# EasyEDA Pro project ProPrj_PRISM102 Peripheral Control_2026-04-10.epro

# Schematic Schematic1

## Sheets
1 Drivers / DC-DC: Assembly Variant: Basic; Board Name: Board1; Create Date: 2026-03-30; Page Name: P1; Project Name: PRISM Peri Control; Schematic Name: Schematic1; Update Date: 2026-03-30; BladeWidth: 10; Page Size: A4; RegionStart: 1; ShowBorder: 1; TitleBlock: 1; TitleBlockPosition: 3; Version: V1.0; XRegionCount: 6; YRegionCount: 4
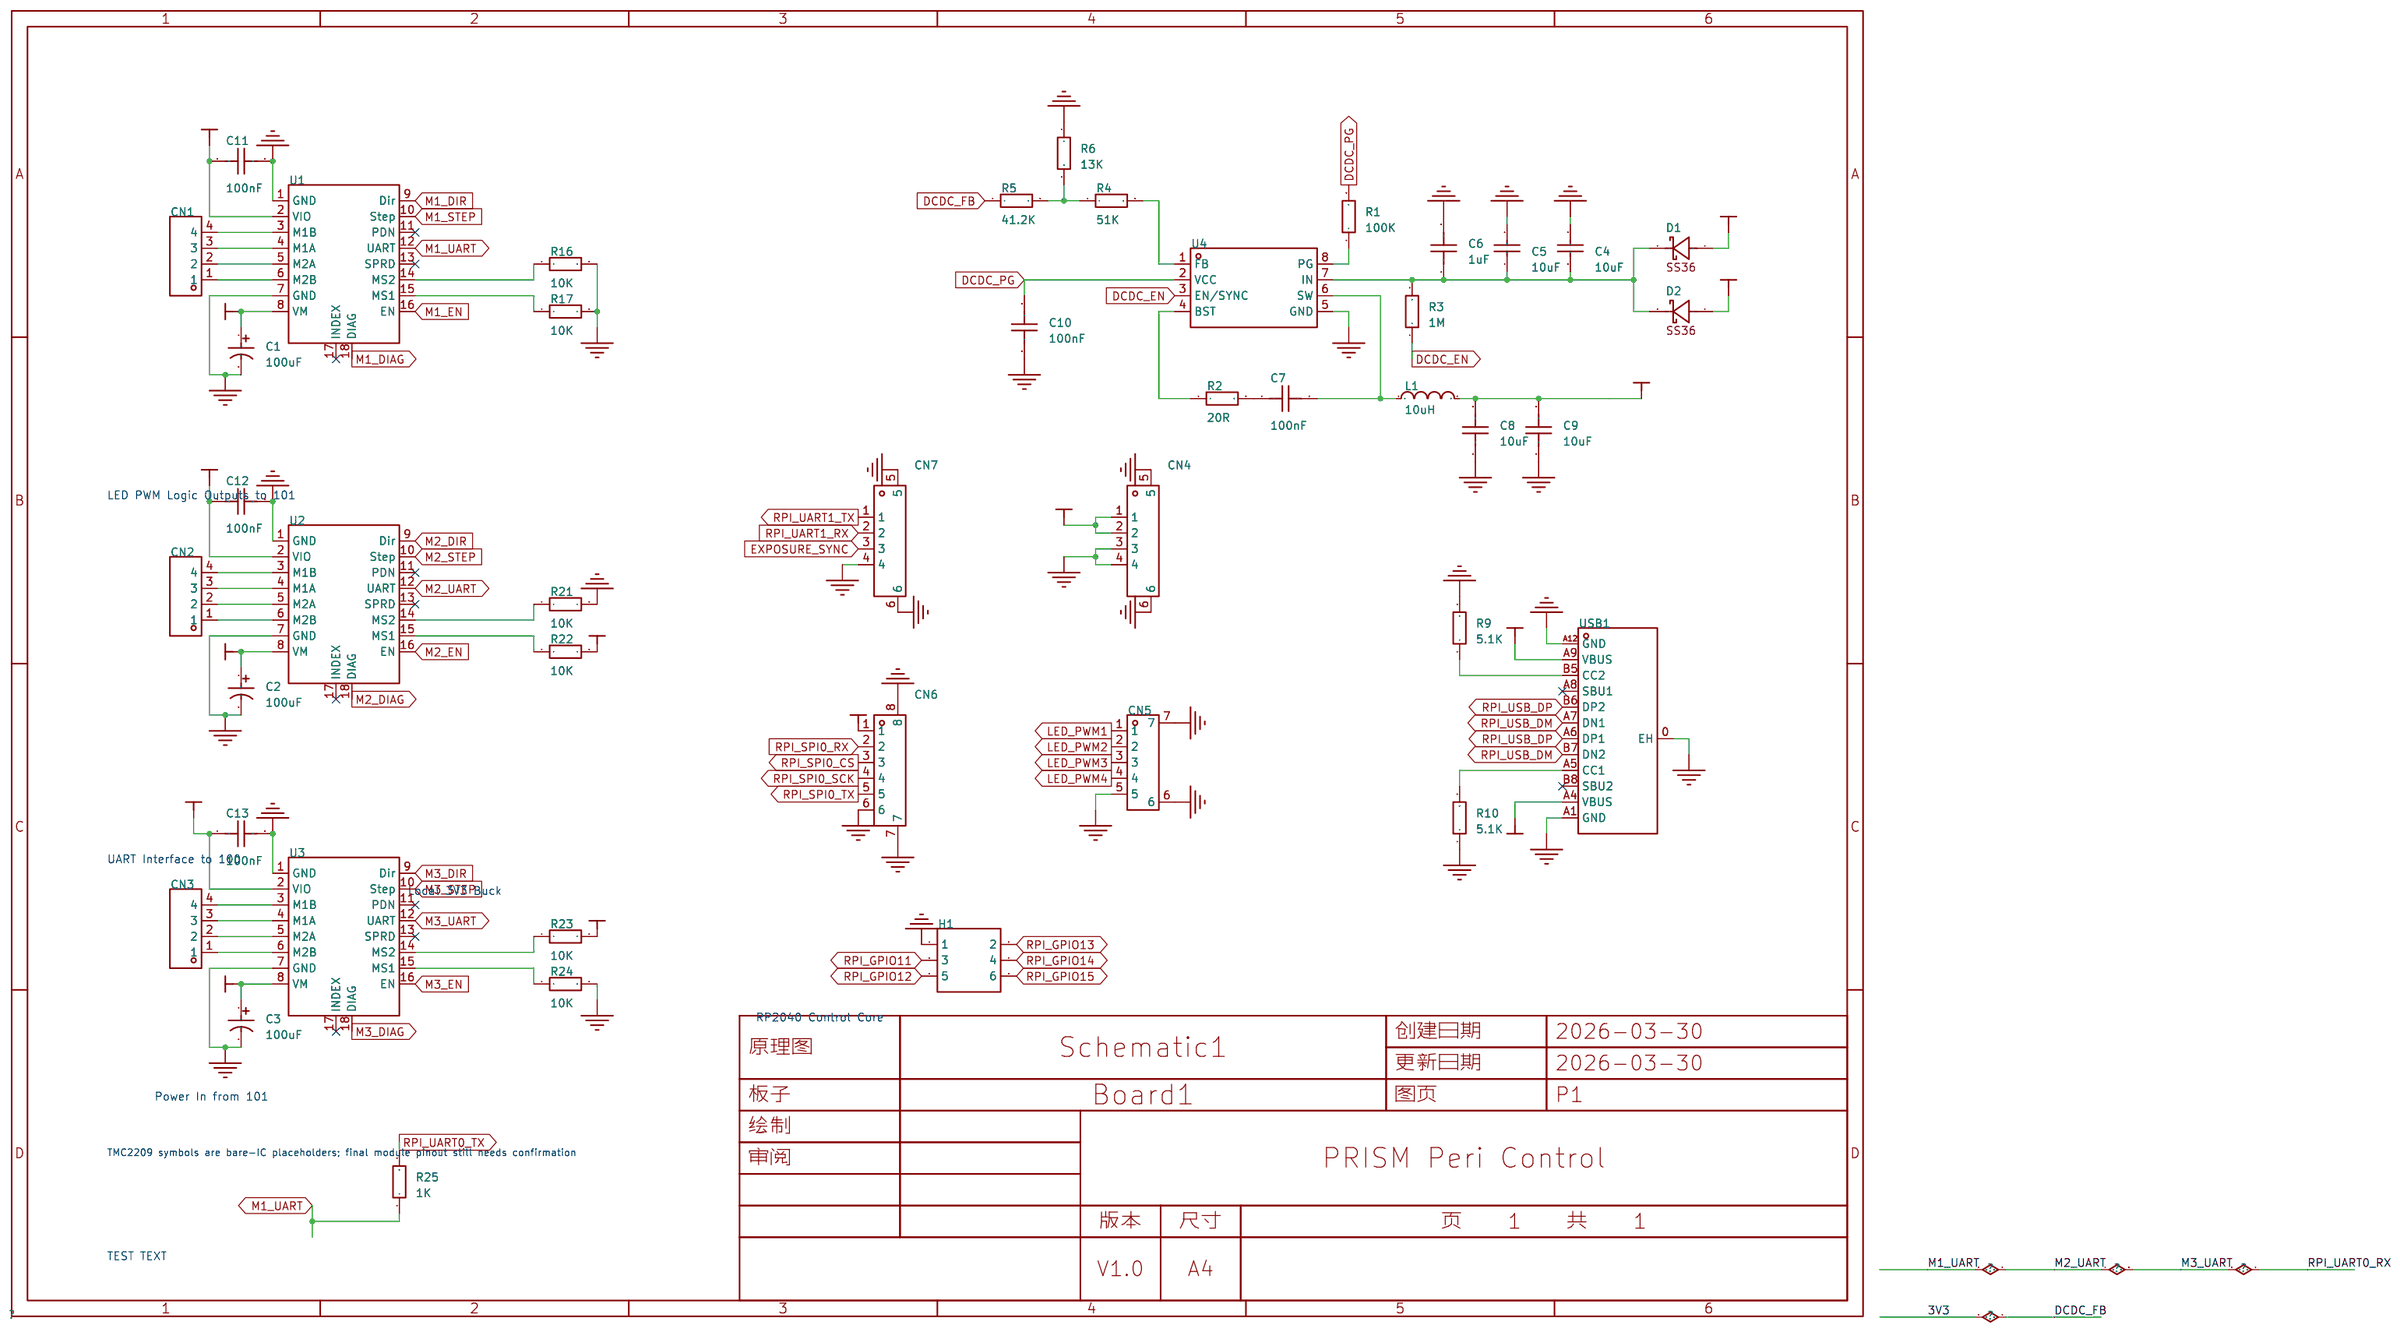
[diagram p0: Drivers / DC-DC]
2 P2_RP2040: Create Date: 2026-04-01; Project Name: PRISM102 Peripheral Control; Update Date: 2026-04-01
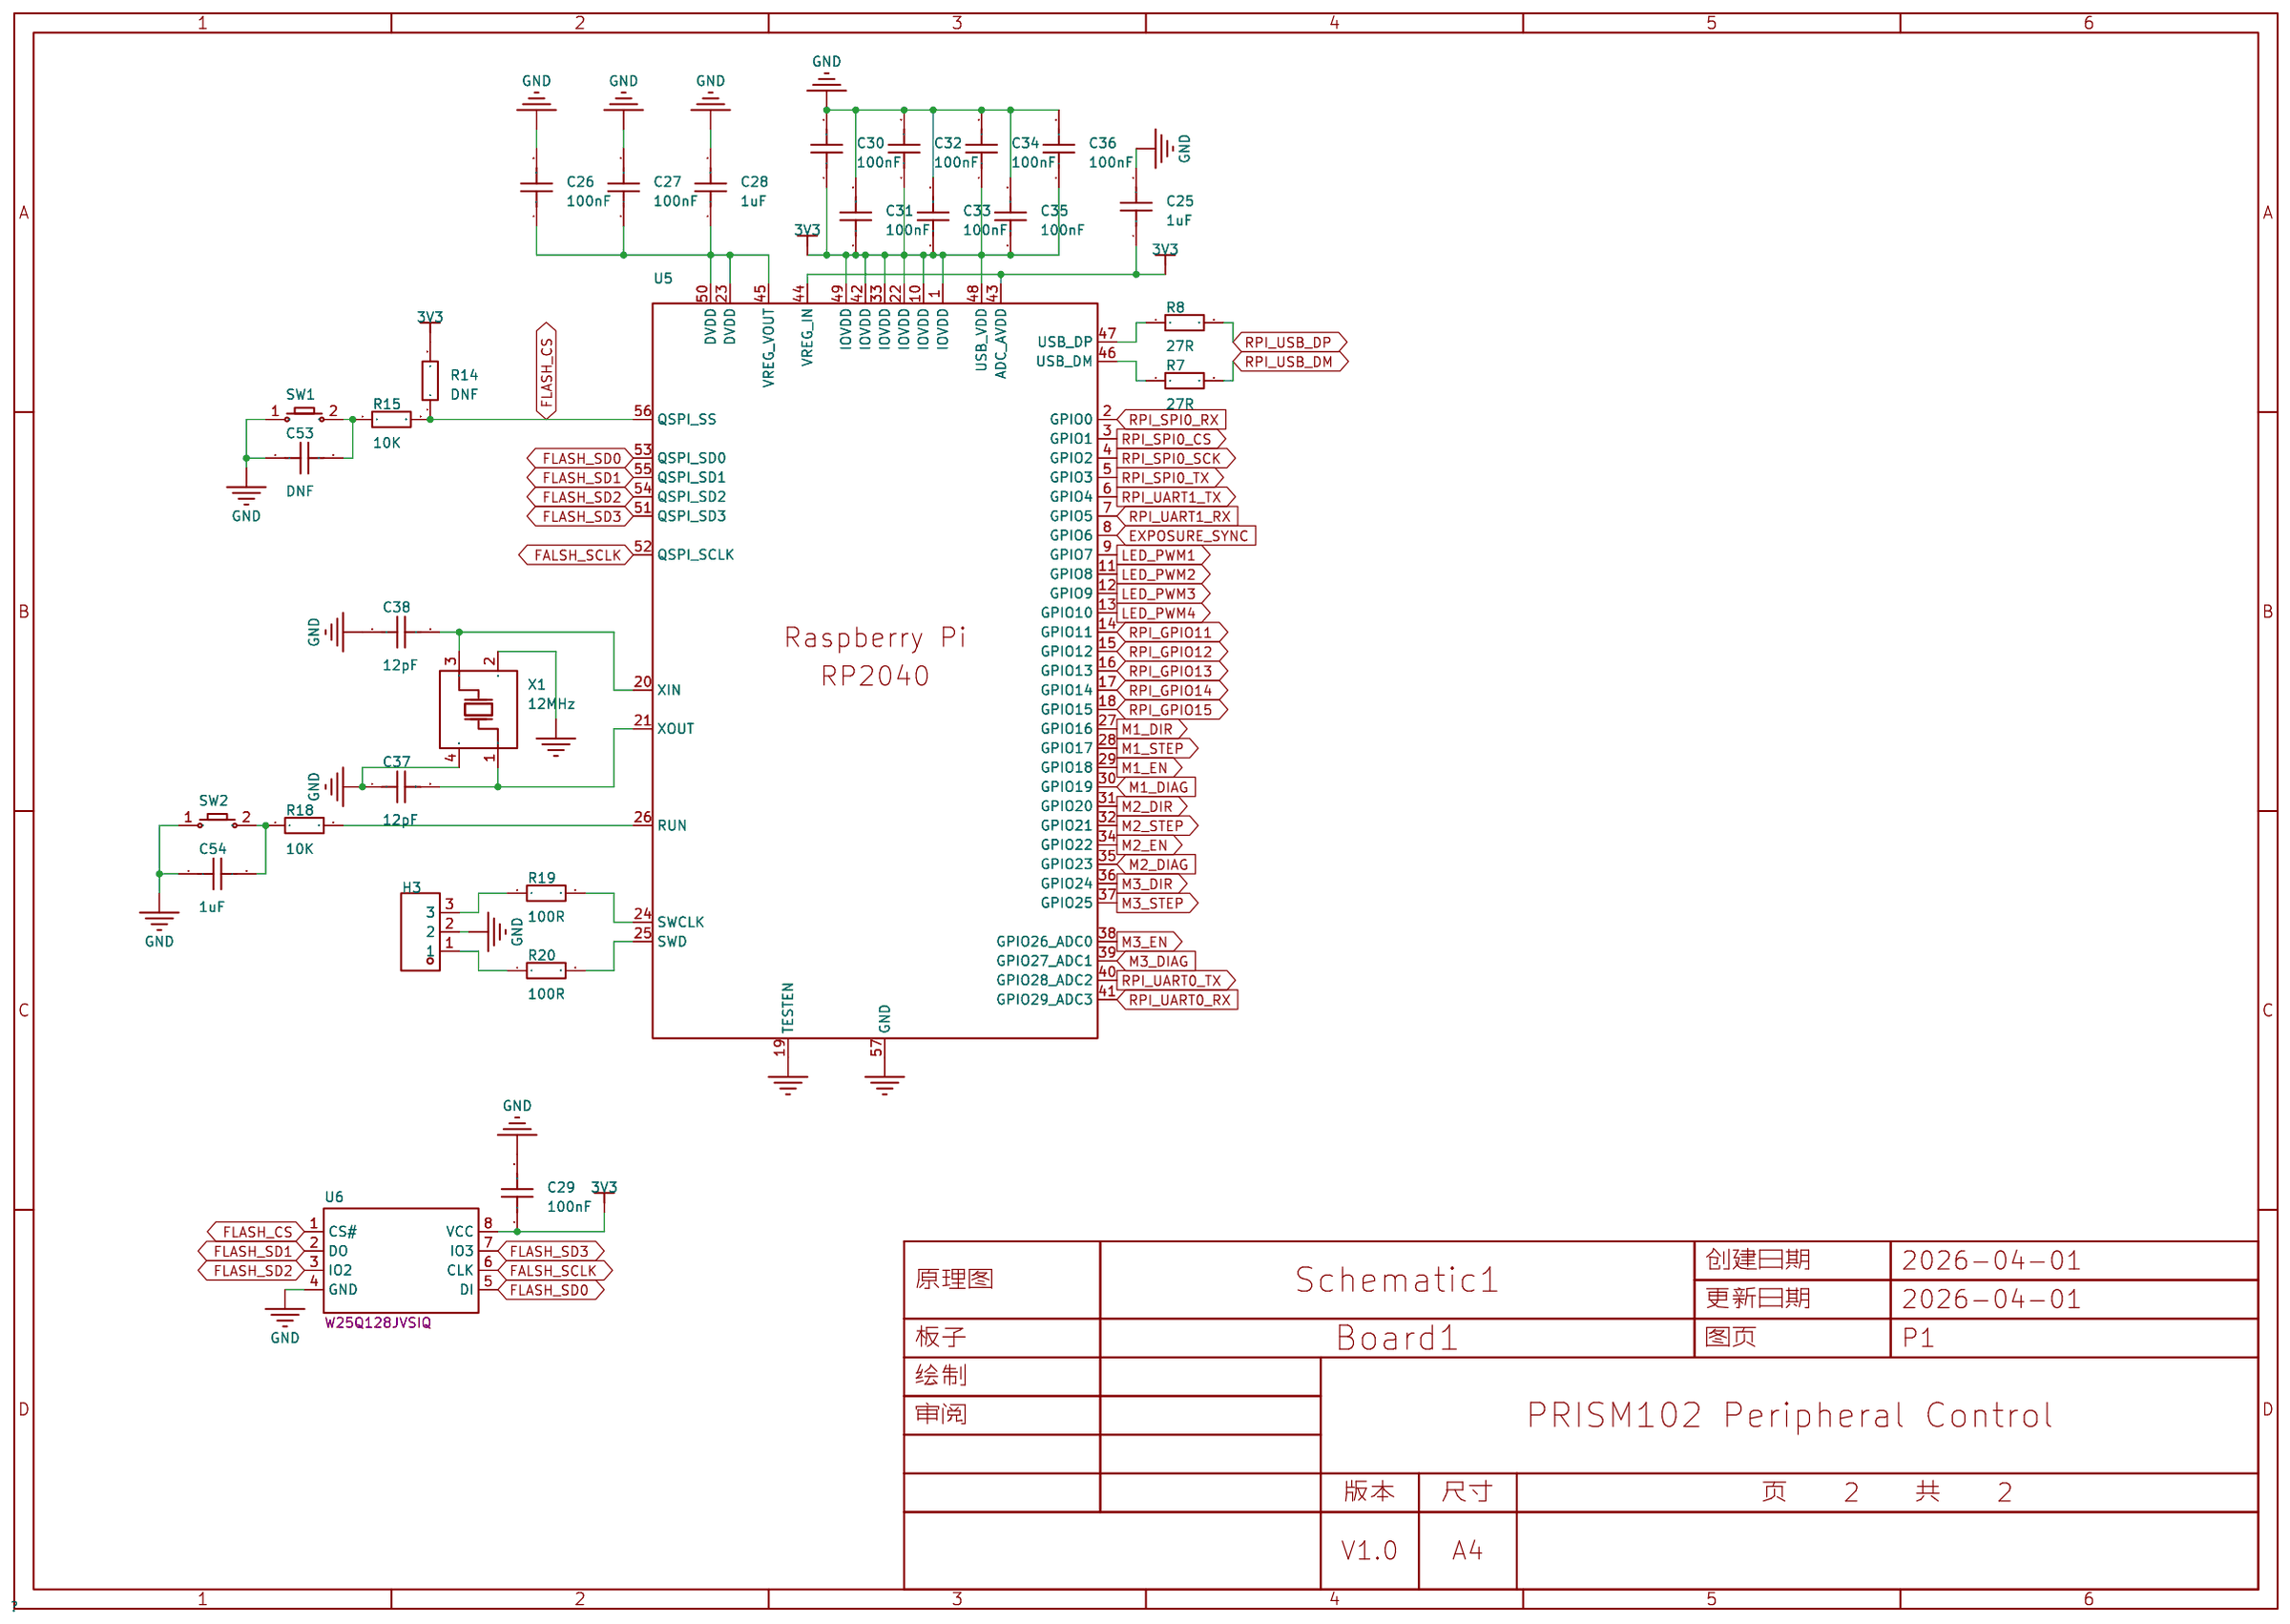
[diagram p1: P2_RP2040]

## Parts
sheet Drivers / DC-DC
C1  100uF  [CAP-TH_BD8.0-P3.50-D0.6-FD]
C2  100uF  [CAP-TH_BD8.0-P3.50-D0.6-FD]
C3  100uF  [CAP-TH_BD8.0-P3.50-D0.6-FD]
C4  10uF  [C1206]
C5  10uF  [C1206]
C6  1uF  [C0603]
C7  100nF  [C0603]
C8  10uF  [C0805]
C9  10uF  [C0805]
C10  100nF  [C0603]
C11  100nF  [C0603]
C12  100nF  [C0603]
C13  100nF  [C0603]
CN1  ZX-XH2.54-4PZZ  [CONN-TH_4P-P2.50_4PIN]
CN2  ZX-XH2.54-4PZZ  [CONN-TH_4P-P2.50_4PIN]
CN3  ZX-XH2.54-4PZZ  [CONN-TH_4P-P2.50_4PIN]
CN4  ZX-XH2.54-4PLT  [CONN-SMD_4P-P2.54_C9900012758]
CN5  ZX-XH2.54-5PLT  [CONN-SMD_5P-P2.50_ZX-XH2.54-5PLT]
CN6  ZX-XH2.54-6PLT  [CONN-SMD_6P-P2.50_ZX-XH2.54-6PLT]
CN7  ZX-XH2.54-4PLT  [CONN-SMD_4P-P2.54_C9900012758]
D1  SS36  [SMA_L4.3-W2.6-LS5.0-FD]
D2  SS36  [SMA_L4.3-W2.6-LS5.0-FD]
H1  -  [HDR-TH_6P-P2.54-V-F-R2-C3-S2.54]
L1  10uH  [IND-SMD_L7.3-W6.8]
R1  100K  [R0603]
R2  20R  [R0603]
R3  1M  [R0603]
R4  51K  [R0603]
R5  41.2K  [R0603]
R6  13K  [R0603]
R9  5.1K  [R0603]
R10  5.1K  [R0603]
R16  10K  [R0603]
R17  10K  [R0603]
R21  10K  [R0603]
R22  10K  [R0603]
R23  10K  [R0603]
R24  10K  [R0603]
R25  1K  [R0603]
U1  TMC2209SILENTSTEPSTICK  [COMM-TH_TMC2209SILENTSTEPSTICK]
U2  TMC2209SILENTSTEPSTICK  [COMM-TH_TMC2209SILENTSTEPSTICK]
U3  TMC2209SILENTSTEPSTICK  [COMM-TH_TMC2209SILENTSTEPSTICK]
U4  MP9943GQ-Z  [QFN-8_L3.0-W3.0-P0.65-BL]
USB1  TYPE-C 16P QTWT  [USB-TYPE-C-SMD_TYPE-C-16P-QTWT]
sheet P2_RP2040
C25  1uF  [C0603]
C26  100nF  [C0603]
C27  100nF  [C0603]
C28  1uF  [C0603]
C29  100nF  [C0603]
C30  100nF  [C0603]
C31  100nF  [C0603]
C32  100nF  [C0603]
C33  100nF  [C0603]
C34  100nF  [C0603]
C35  100nF  [C0603]
C36  100nF  [C0603]
C37  12pF  [C0603]
C38  12pF  [C0603]
C53  DNF  [C0603]
C54  1uF  [C0603]
H3  -  [HDR-TH_3P-P2.54-V-M]
R7  27R  [R0603]
R8  27R  [R0603]
R14  DNF  [R0603]
R15  10K  [R0603]
R18  10K  [R0603]
R19  100R  [R0603]
R20  100R  [R0603]
SW1  -  [Key_SMD_3x4x2]
SW2  -  [Key_SMD_3x4x2]
U5  RP2040  [QFN-56_L7.0-W7.0-P0.40-TL-EP4.0]
U6  W25Q128JVSIQ  [SOIC-8_L5.3-W5.3-P1.27-LS8.0-BL]
X1  12MHz  [CRYSTAL-SMD_4P-L3.2-W2.5-BL]

## Library data of the parts
C1-C3 = ERS1HM101F12OT: 容值:100uF;精度:±20%;额定电压:50V;; LCSC Part Name: 100uF ±20% 50V; Supplier Part: C112510; Manufacturer: AISHI(艾华集团); Supplier Footprint: 插件,D8xL12mm; JLCPCB Part Class: Extended Part; Datasheet: https://item.szlcsc.com/datasheet/ERS1HM101F12OT/113743.html; Supplier: LCSC; Tolerance: ±20%; Voltage Rating: 50V; Pin Spacing: 3.5mm; Diameter: 8mm; Height - Seated (Max): 12mm; Lifetime: 7000hrs@105℃
C4 C5 = CL31A106KBHNNNE: 容值:10uF;精度:±10%;额定电压:50V;温度系数:X5R;; LCSC Part Name: 10uF ±10% 50V; Supplier Part: C13585; Manufacturer: SAMSUNG(三星); Supplier Footprint: 1206; JLCPCB Part Class: Basic Part; Datasheet: https://item.szlcsc.com/datasheet/CL31A106KBHNNNE/14236.html; Supplier: LCSC; Tolerance: ±10%; Voltage Rating: 50V; Temperature Coefficient: X5R
C6 = CGA0603X5R105K500JT: 容值:1uF;精度:±10%;额定电压:50V;温度系数:X5R;; LCSC Part Name: 1uF ±10% 50V; Supplier Part: C6119852; Manufacturer: HRE(芯声); Supplier Footprint: 0603; JLCPCB Part Class: Extended Part; Datasheet: https://item.szlcsc.com/datasheet/CGA0603X5R105K500JT/7062558.html; Supplier: LCSC; Tolerance: ±10%; Voltage Rating: 50V; Temperature Coefficient: X5R
C7 C10-C13 C25-C38 C53 C54 = CAP_0603: Supplier Footprint: 0603
C8 C9 = CL21A106KAYNNNE_C15850: 容值:10uF;精度:±10%;额定电压:25V;温度系数:X5R;; LCSC Part Name: 10uF ±10% 25V; Supplier Part: C15850; Manufacturer: SAMSUNG(三星); Manufacturer Part: CL21A106KAYNNNE; Supplier Footprint: 0805; JLCPCB Part Class: Basic Part; Datasheet: https://item.szlcsc.com/datasheet/CL21A106KAYNNNE/16532.html; Supplier: LCSC; Tolerance: ±10%; Voltage Rating: 25V; Temperature Coefficient: X5R
CN1-CN3 = ZX-XH2.54-4PZZ: 插针结构:1x4P;间距:2.5mm;安装方式:直插;参考系列:XH;总PIN数:4P;排数:1;每排PIN数:4;行距:-;额定电流:3A;触头材质:黄铜;触头镀层:锡;工作温度:-25℃~+85℃;; LCSC Part Name: 1x4P 间距:2.5mm 直插 系列:XH; Supplier Part: C7429634; Manufacturer: Megastar(兆星); Supplier Footprint: 插件,P=2.5mm; JLCPCB Part Class: Extended Part; Datasheet: https://item.szlcsc.com/datasheet/ZX-XH2.54-4PZZ/8427551.html; Supplier: LCSC; Pins Structure: 1x4P; Pitch: 2.5mm; Mounting Type: 直插; Reference Series: XH; Number of Pins: 4P; Number of Rows: 1; Number of PINs Per Row: 4; Current Rating: 3A; Contact Material: 黄铜; Contact Plating: 锡; Operating Temperature: -25℃~+85℃; Voltage Rating: 250V; Plastic Material: PA66; Flame Retardant Rating: UL94V-0; Color: 白色; Z-Height of the Board: 7mm; X-Length of Bottom Edge on Board (Spacing Line): 12.5mm; Y-Width of Bottom Edge on Board: 5.9mm
CN4 CN7 = ZX-XH2.54-4PLT: 插针结构:1x4P;间距:2.5mm;安装方式:立贴;参考系列:XH;总PIN数:4P;排数:1;每排PIN数:4;行距:-;额定电流:3A;触头材质:黄铜;触头镀层:锡;工作温度:-25℃~+85℃;; LCSC Part Name: 1x4P 间距:2.5mm 立贴 系列:XH; Supplier Part: C7429682; Manufacturer: Megastar(兆星); Supplier Footprint: SMD,P=2.5mm; JLCPCB Part Class: Extended Part; Datasheet: https://item.szlcsc.com/datasheet/ZX-XH2.54-4PLT/8427599.html; Supplier: LCSC; Pins Structure: 1x4P; Pitch: 2.5mm; Mounting Type: 立贴; Reference Series: XH; Number of Pins: 4P; Number of Rows: 1; Number of PINs Per Row: 4; Current Rating: 3A; Contact Material: 黄铜; Contact Plating: 锡; Operating Temperature: -25℃~+85℃; Voltage Rating: 250V; Plastic Material: LCP; Supplementary Features: 辅助焊脚; Color: 米色; Z-Height of the Board: 7.9mm; X-Length of Bottom Edge on Board (Spacing Line): 15mm; Y-Width of Bottom Edge on Board: 5.95mm
CN5 = ZX-XH2.54-5PLT: 插针结构:1x5P;间距:2.5mm;安装方式:立贴;参考系列:XH;总PIN数:5P;排数:1;每排PIN数:5;行距:-;额定电流:3A;触头材质:黄铜;触头镀层:锡;工作温度:-25℃~+85℃;; LCSC Part Name: 1x5P 间距:2.5mm 立贴 系列:XH; Supplier Part: C7429683; Manufacturer: Megastar(兆星); Supplier Footprint: SMD,P=2.5mm; JLCPCB Part Class: Extended Part; Datasheet: https://item.szlcsc.com/datasheet/ZX-XH2.54-5PLT/8427600.html; Supplier: LCSC; Pins Structure: 1x5P; Pitch: 2.5mm; Mounting Type: 立贴; Reference Series: XH; Number of Pins: 5P; Number of Rows: 1; Number of PINs Per Row: 5; Current Rating: 3A; Contact Material: 黄铜; Contact Plating: 锡; Operating Temperature: -25℃~+85℃; Voltage Rating: 250V; Plastic Material: LCP; Supplementary Features: 辅助焊脚; Color: 米色; Z-Height of the Board: 7.9mm; X-Length of Bottom Edge on Board (Spacing Line): 17.5mm; Y-Width of Bottom Edge on Board: 5.95mm
CN6 = ZX-XH2.54-6PLT: 插针结构:1x6P;间距:2.5mm;安装方式:立贴;参考系列:XH;总PIN数:6P;排数:1;每排PIN数:6;行距:-;额定电流:3A;触头材质:黄铜;触头镀层:锡;工作温度:-25℃~+85℃;; LCSC Part Name: 1x6P 间距:2.5mm 立贴 系列:XH; Supplier Part: C7429684; Manufacturer: Megastar(兆星); Supplier Footprint: SMD,P=2.5mm; JLCPCB Part Class: Extended Part; Datasheet: https://item.szlcsc.com/datasheet/ZX-XH2.54-6PLT/8427601.html; Supplier: LCSC; Pins Structure: 1x6P; Pitch: 2.5mm; Mounting Type: 立贴; Reference Series: XH; Number of Pins: 6P; Number of Rows: 1; Number of PINs Per Row: 6; Current Rating: 3A; Contact Material: 黄铜; Contact Plating: 锡; Operating Temperature: -25℃~+85℃; Voltage Rating: 250V; Plastic Material: LCP; Supplementary Features: 辅助焊脚; Color: 米色; Z-Height of the Board: 7.9mm; X-Length of Bottom Edge on Board (Spacing Line): 20mm; Y-Width of Bottom Edge on Board: 5.95mm
D1 D2 = SS36_C7420367: 二极管配置:独立式;正向压降(Vf):700mV@3.0A;直流反向耐压(Vr):60V;整流电流:3A;; LCSC Part Name: 电压:60V 电流:3A; Supplier Part: C7420367; Manufacturer: R+O(宏嘉诚); Supplier Footprint: SMA(DO-214AC); JLCPCB Part Class: Extended Part; Datasheet: https://item.szlcsc.com/datasheet/SS36/8397189.html; Supplier: LCSC; Diode Configuration: 独立式; Voltage - Forward(Vf@If): 700mV@3.0A; Voltage - DC Reverse(Vr): 60V; Current - Rectified: 3A; Reverse Leakage Current (Ir): 10mA@60V; Operating Junction Temperature Range: -55℃~+150℃; Non-Repetitive Peak Forward Surge Current: 80A
H1 = HDR-F_2.54_2x3: Supplier Part: C92272; Supplier Footprint: 插件
L1 = FXL0630-100-M: 电感值:10uH;精度:±20%;额定电流:4.5A;饱和电流(Isat):5.5A;类型:一体成型电感;; LCSC Part Name: 10uH ±20% 5.5A; Supplier Part: C167223; Manufacturer: cjiang(长江微电); Supplier Footprint: SMD,7x6.6mm; JLCPCB Part Class: Extended Part; Datasheet: https://item.szlcsc.com/datasheet/FXL0630-100-M/178606.html; Supplier: LCSC; Tolerance: ±20%; Current Rating: 4.5A; Current - Saturation(Isat): 5.5A; DC Resistance(DCR): 68mΩ; Type: 一体成型电感
R1-R10 R14-R25 = Res_0603: Supplier Footprint: 0603
U1-U3 = TMC2209SILENTSTEPSTICK: 类型:电源管理;; Supplier Part: C17375345; Manufacturer: TRINAMIC; JLCPCB Part Class: Extended Part; Datasheet: https://item.szlcsc.com/datasheet/TMC2209SILENTSTEPSTICK/18504516.html; Supplier: LCSC; Type: 电源管理
U4 = MP9943GQ-Z: 功能类型:降压型;工作电压:4V~36V;输出电压:800mV~28.5V;输出电流:3A;输出类型:可调;; Supplier Part: C477821; Manufacturer: MPS(芯源); Supplier Footprint: QFN-8(3x3); JLCPCB Part Class: Extended Part; Datasheet: https://item.szlcsc.com/datasheet/MP9943GQ-Z/484763.html; Supplier: LCSC; Function: 降压型; Voltage - Supply: 4V~36V; Output Voltage: 800mV~28.5V; Output Current: 3A; Frequency - Switching: 410kHz；200kHz~2.2MHz; Operating Temperature: -40℃~+125℃@(TJ); Synchronous Rectifier: 是; Number of Outputs: 1; Topology: 降压式; Quiescent Current: 500uA; Switch tube (built-in/external): 内置; Output Type: 可调
USB1 = TYPE-C 16P QTWT: 连接器类型:Type-C;协议标准:-;公母:母;安装方式:卧贴;触点数量:16P;端口数量:1;额定电流 - 电源:3A;工作温度:-25℃~+85℃;; LCSC Part Name: 16P卧贴母座; Supplier Part: C5187472; Manufacturer: SHOU HAN(首韩); Supplier Footprint: SMD; JLCPCB Part Class: Extended Part; Datasheet: https://item.szlcsc.com/datasheet/TYPE-C%252016P%2520QTWT/5860367.html; Supplier: LCSC; Connector Type: Type-C; Gender: 母; Mounting Type: 卧贴; Number of Contacts: 16P; Number of Ports: 1; Current Rating-Power: 3A; Voltage Rating: 5V; Connect-Disconnect Life: 5千次; Detection color: 黑色; Operating Temperature: -25℃~+85℃
H3 = HDR-M_2.54_1x3P: Supplier Part: C2937625; Supplier Footprint: 插件
SW1 SW2 = Key_SMD_3x4x2: Supplier Footprint: SMD
U5 = RP2040: Supplier Part: C2961140; Manufacturer: Raspberry Pi(树莓派); Supplier Footprint: QFN-56-EP(7x7); JLCPCB Part Class: Extended Part; Datasheet: https://atta.szlcsc.com/upload/public/pdf/source/20220208/8D54DD1C91A7987165C42A5C4D6BB336.pdf; Supplier: LCSC
U6 = W25Q128JVSIQ: 接口类型:SPI;存储容量:128Mbit;时钟频率(fc):133MHz;; LCSC Part Name: 编带 支持双路/四路SPI接口的3V、128Mbit 串行闪存; Supplier Part: C97521; Manufacturer: Winbond(华邦); Supplier Footprint: SOIC-8-208mil; JLCPCB Part Class: Basic Part; Datasheet: https://item.szlcsc.com/datasheet/W25Q128JVSIQ/98729.html; Supplier: LCSC; Interface: SPI; Memory Size: 128Mbit; Clock Frequency: 133MHz; Voltage - Supply: 2.7V~3.6V; Standby Supply Current: 1uA; Program / Erase Cycles: 100000次; Page Programming Time (Tpp): 3ms; Block Erase Time(tBE): 120ms@(32KB); Data Retention - TDR (Year): 20年; Operating Temperature: -40℃~+85℃
X1 = X322512MSB4SI: 晶振类型:贴片晶振;频率:12MHz;常温频差:±10ppm;负载电容:20pF;频率稳定度:±20ppm;; LCSC Part Name: YSX321SL 12MHZ 4P 3225 20PF ±10PPM -40~85℃ (±20PPM); Supplier Part: C9002; Manufacturer: YXC(扬兴晶振); Supplier Footprint: SMD3225-4P; JLCPCB Part Class: Basic Part; Datasheet: https://item.szlcsc.com/datasheet/X322512MSB4SI/9522.html; Supplier: LCSC; Type: 贴片晶振; Normal temperature Frequency Tolerance: ±10ppm; Load Capacitance: 20pF; Frequency Stability: ±20ppm; Operating Temperature: -40℃~+85℃

## Nets
3V3: C8.2 C9.2 C11.2 C12.1 C13.1 C25.1 C29.1 C30.1 C31.1 C32.1 C33.1 C34.1 C35.1 C36.1 CN6.1 L1.2 R5.1 R14.2 R22.2 R23.2 U1.2(VIO) U2.2(VIO) U3.2(VIO) U5.1(IOVDD) U5.10(IOVDD) U5.22(IOVDD) U5.33(IOVDD) U5.42(IOVDD) U5.43(ADC_AVDD) U5.44(VREG_IN) U5.48(USB_VDD) U5.49(IOVDD) U6.8(VCC)
20V: C1.1 C2.1 C3.1 CN4.1 CN4.2 D1.1(A) U1.8(VM) U2.8(VM) U3.8(VM)
GND: C1.2 C2.2 C3.2 C4.2 C5.2 C6.2 C8.1 C9.1 C10.2 C11.1 C12.2 C13.2 C25.2 C26.2 C27.2 C28.2 C29.2 C30.2 C31.2 C32.2 C33.2 C34.2 C35.2 C36.2 C37.1 C38.1 C53.1 C54.1 CN4.3 CN4.4 CN4.5 CN4.6 CN5.5 CN5.6 CN5.7 CN6.6 CN6.7 CN6.8 CN7.4 CN7.5 CN7.6 H1.1 H3.2 R6.1 R9.2 R10.1 R16.2 R17.2 R21.2 R24.2 SW1.1 SW2.1 U1.1(GND) U1.7(GND) U2.1(GND) U2.7(GND) U3.1(GND) U3.7(GND) U4.5(GND) U5.19(TESTEN) U5.57(GND) U6.4(GND) USB1.0(EH) USB1.A1(GND) USB1.A12(GND) X1.2(GND) X1.4(GND)
VBUS: D2.1(A) USB1.A4(VBUS) USB1.A9(VBUS)
DCDC_EN: R3.1 U4.3(EN/SYNC)
DCDC_PG: C10.1 R1.2 U4.2(VCC)
EXPOSURE_SYNC: CN7.3 U5.8(GPIO6)
FALSH_SCLK: U5.52(QSPI_SCLK) U6.6(CLK)
FLASH_CS: R14.1 R15.2 U5.56(QSPI_SS) U6.1(CS#)
FLASH_SD0: U5.53(QSPI_SD0) U6.5(DI)
FLASH_SD1: U5.55(QSPI_SD1) U6.2(DO)
FLASH_SD2: U5.54(QSPI_SD2) U6.3(IO2)
FLASH_SD3: U5.51(QSPI_SD3) U6.7(IO3)
LED_PWM1: CN5.1 U5.9(GPIO7)
LED_PWM2: CN5.2 U5.11(GPIO8)
LED_PWM3: CN5.3 U5.12(GPIO9)
LED_PWM4: CN5.4 U5.13(GPIO10)
M1_DIAG: U1.18(DIAG) U5.30(GPIO19)
M1_DIR: U1.9(Dir) U5.27(GPIO16)
M1_EN: U1.16(EN) U5.29(GPIO18)
M1_STEP: U1.10(Step) U5.28(GPIO17)
M1_UART: R25.1 U1.12(UART) U2.12(UART) U3.12(UART) U5.41(GPIO29_ADC3)
M2_DIAG: U2.18(DIAG) U5.35(GPIO23)
M2_DIR: U2.9(Dir) U5.31(GPIO20)
M2_EN: U2.16(EN) U5.34(GPIO22)
M2_STEP: U2.10(Step) U5.32(GPIO21)
M3_DIAG: U3.18(DIAG) U5.39(GPIO27_ADC1)
M3_DIR: U3.9(Dir) U5.36(GPIO24)
M3_EN: U3.16(EN) U5.38(GPIO26_ADC0)
M3_STEP: U3.10(Step) U5.37(GPIO25)
RPI_GPIO11: H1.3 U5.14(GPIO11)
RPI_GPIO12: H1.5 U5.15(GPIO12)
RPI_GPIO13: H1.2 U5.16(GPIO13)
RPI_GPIO14: H1.4 U5.17(GPIO14)
RPI_GPIO15: H1.6 U5.18(GPIO15)
RPI_SPI0_CS: CN6.3 U5.3(GPIO1)
RPI_SPI0_RX: CN6.2 U5.2(GPIO0)
RPI_SPI0_SCK: CN6.4 U5.4(GPIO2)
RPI_SPI0_TX: CN6.5 U5.5(GPIO3)
RPI_UART0_TX: R25.2 U5.40(GPIO28_ADC2)
RPI_UART1_RX: CN7.2 U5.7(GPIO5)
RPI_UART1_TX: CN7.1 U5.6(GPIO4)
RPI_USB_DM: R7.2 USB1.A7(DN1) USB1.B7(DN2)
RPI_USB_DP: R8.2 USB1.A6(DP1) USB1.B6(DP2)
$1N42: CN3.4 U3.3(M1B)
$1N43: CN3.3 U3.4(M1A)
$1N44: CN3.2 U3.5(M2A)
$1N45: CN3.1 U3.6(M2B)
$1N46: CN2.4 U2.3(M1B)
$1N47: CN2.3 U2.4(M1A)
$1N48: CN2.2 U2.5(M2A)
$1N49: CN2.1 U2.6(M2B)
$1N50: CN1.4 U1.3(M1B)
$1N51: CN1.3 U1.4(M1A)
$1N52: CN1.2 U1.5(M2A)
$1N53: CN1.1 U1.6(M2B)
$1N62: R1.1 U4.8(PG)
$1N63: C4.1 C5.1 C6.1 D1.2(K) D2.2(K) R3.2 U4.7(IN)
$1N68: C7.1 R2.2
$1N69: R2.1 U4.4(BST)
$1N70: C7.2 L1.1 U4.6(SW)
$1N77: R4.1 R5.2 R6.2
$1N78: R4.2 U4.1(FB)
$1N115: R10.2 USB1.A5(CC1)
$1N116: R9.1 USB1.B5(CC2)
$1N122: R16.1 U1.14(MS2)
$1N123: R17.1 U1.15(MS1)
$1N126: R22.1 U2.15(MS1)
$1N127: R21.1 U2.14(MS2)
$1N129: R24.1 U3.15(MS1)
$1N130: R23.1 U3.14(MS2)
$3N13: H3.3 R19.1
$3N14: H3.1 R20.1
$3N15: R20.2 U5.25(SWD)
$3N16: R19.2 U5.24(SWCLK)
$3N18: C37.2 U5.21(XOUT) X1.1(OSC1)
$3N19: C38.2 U5.20(XIN) X1.3(OSC2)
$3N20: C54.2 R18.1 SW2.2
$3N22: R18.2 U5.26(RUN)
$3N28: C53.2 R15.1 SW1.2
$3N38: C26.1 C27.1 C28.1 U5.23(DVDD) U5.45(VREG_VOUT) U5.50(DVDD)
$3N43: R8.1 U5.47(USB_DP)
$3N45: R7.1 U5.46(USB_DM)

Not connected (* = marked no-connect by the designer): U1 11(PDN)* 13(SPRD)* 17(INDEX)*; U2 11(PDN)* 13(SPRD)* 17(INDEX)*; U3 11(PDN)* 13(SPRD)* 17(INDEX)*; USB1 A8(SBU1)* B8(SBU2)*

## Notes on the sheets
sheet 1
- LED PWM Logic Outputs to 101
- UART Interface to 100
- Local 3V3 Buck
- RP2040 Control Core
- Power In from 101
- TMC2209 symbols are bare-IC placeholders; final module pinout still needs confirmation
- TEST TEXT

# Board PRISM102 Peripheral Control
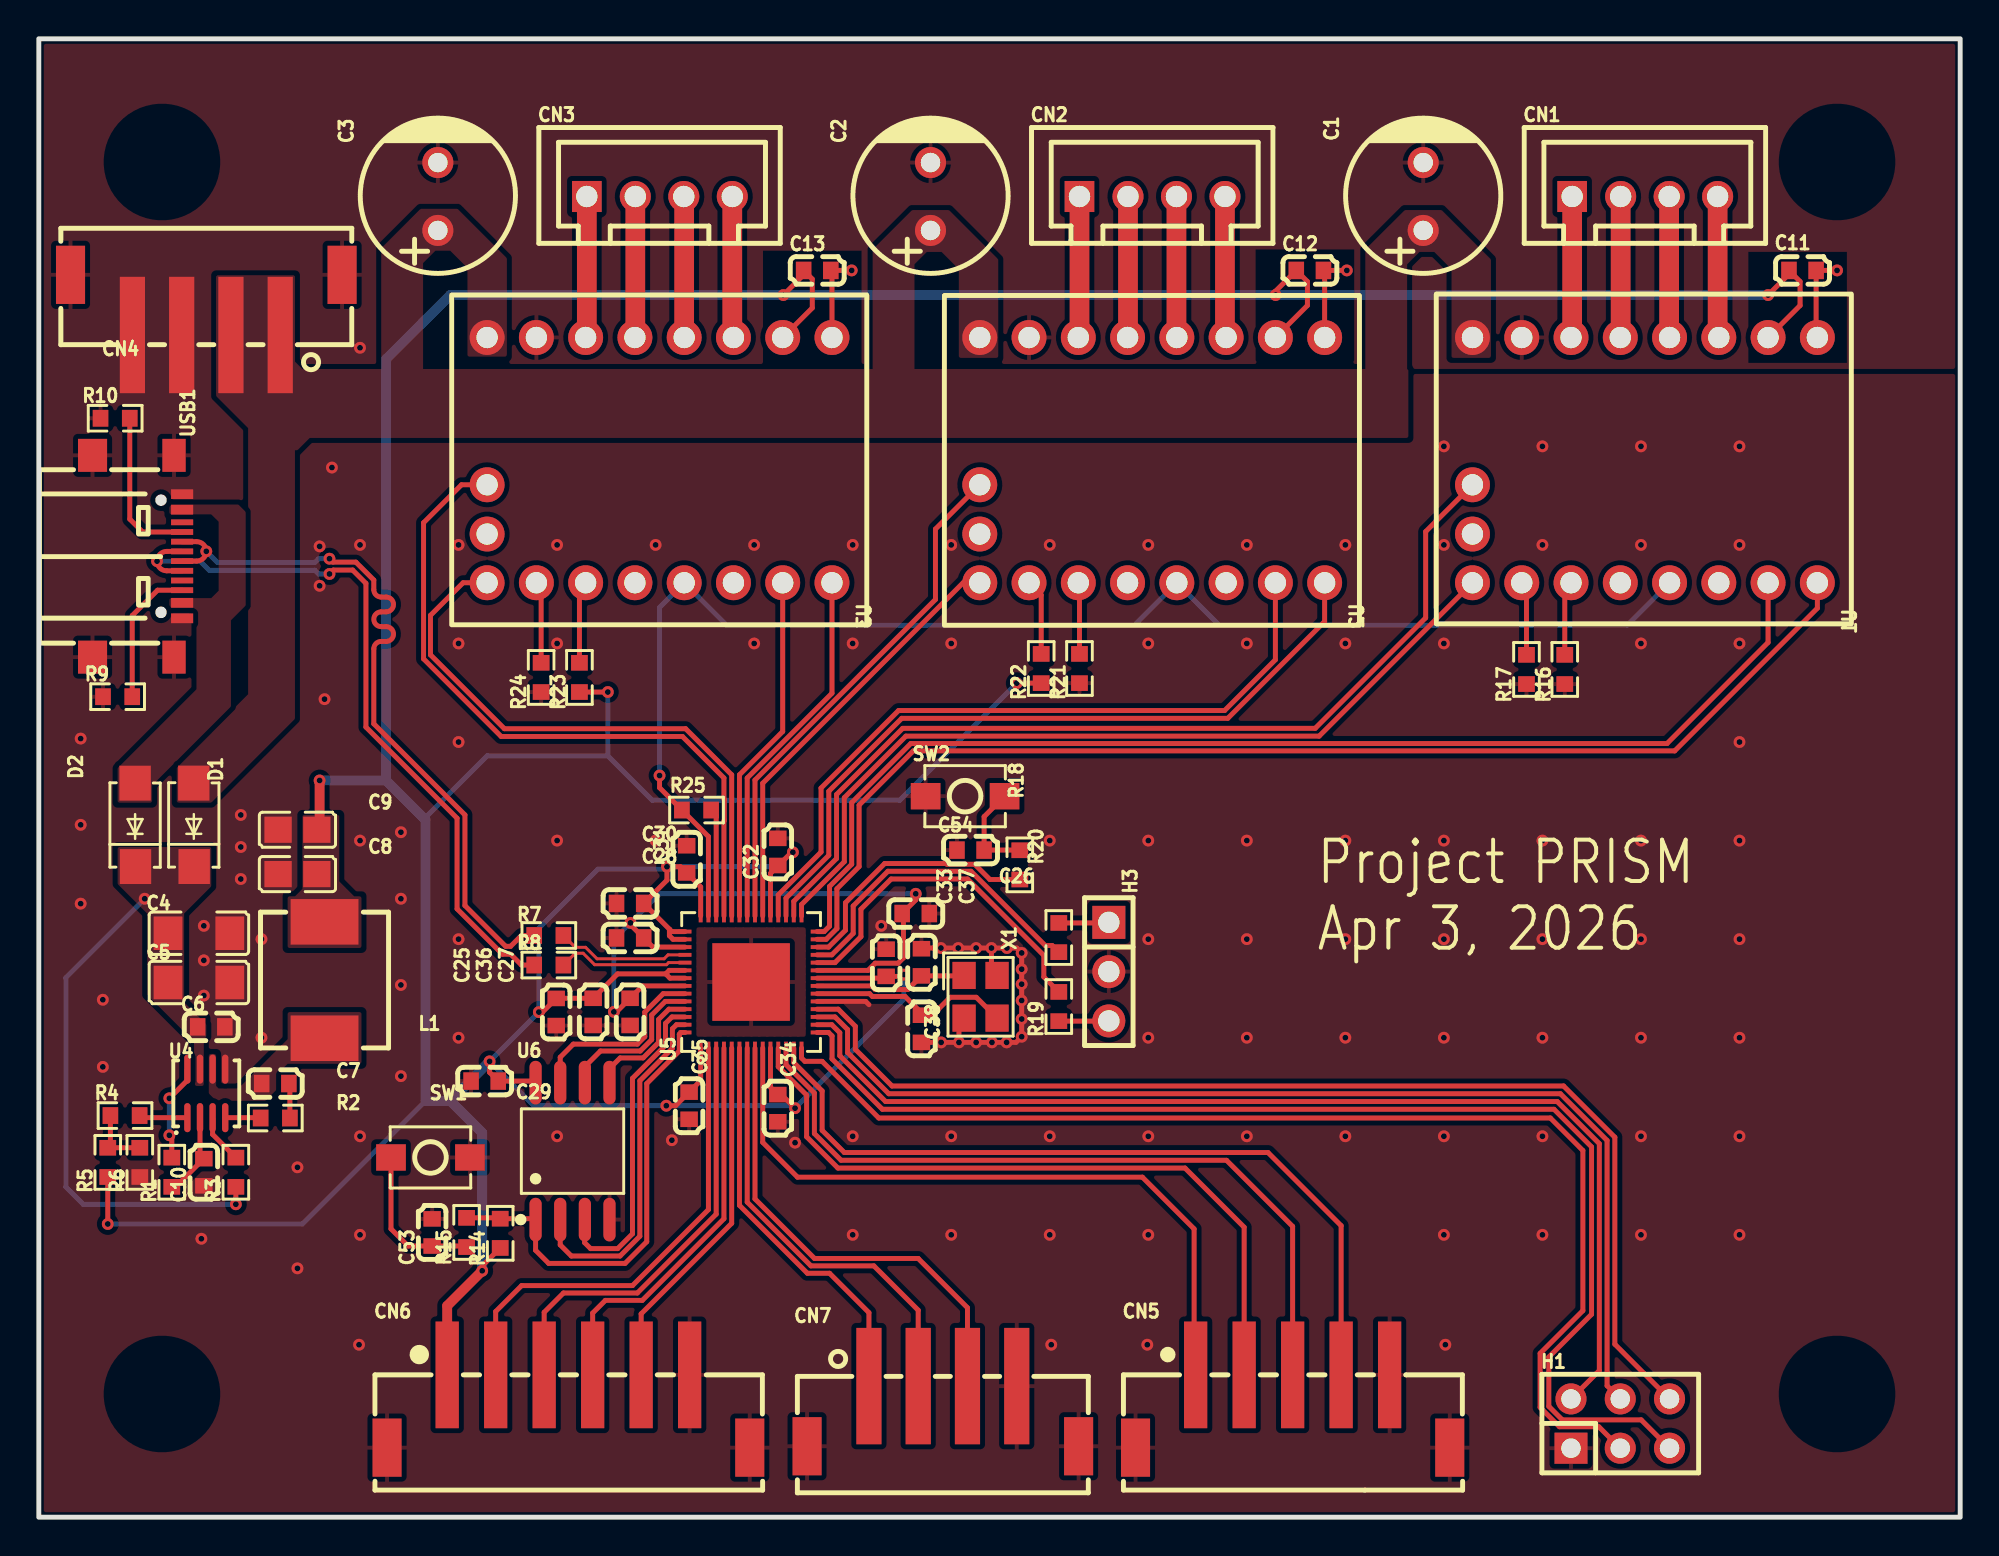
[diagram p2: board, top side]
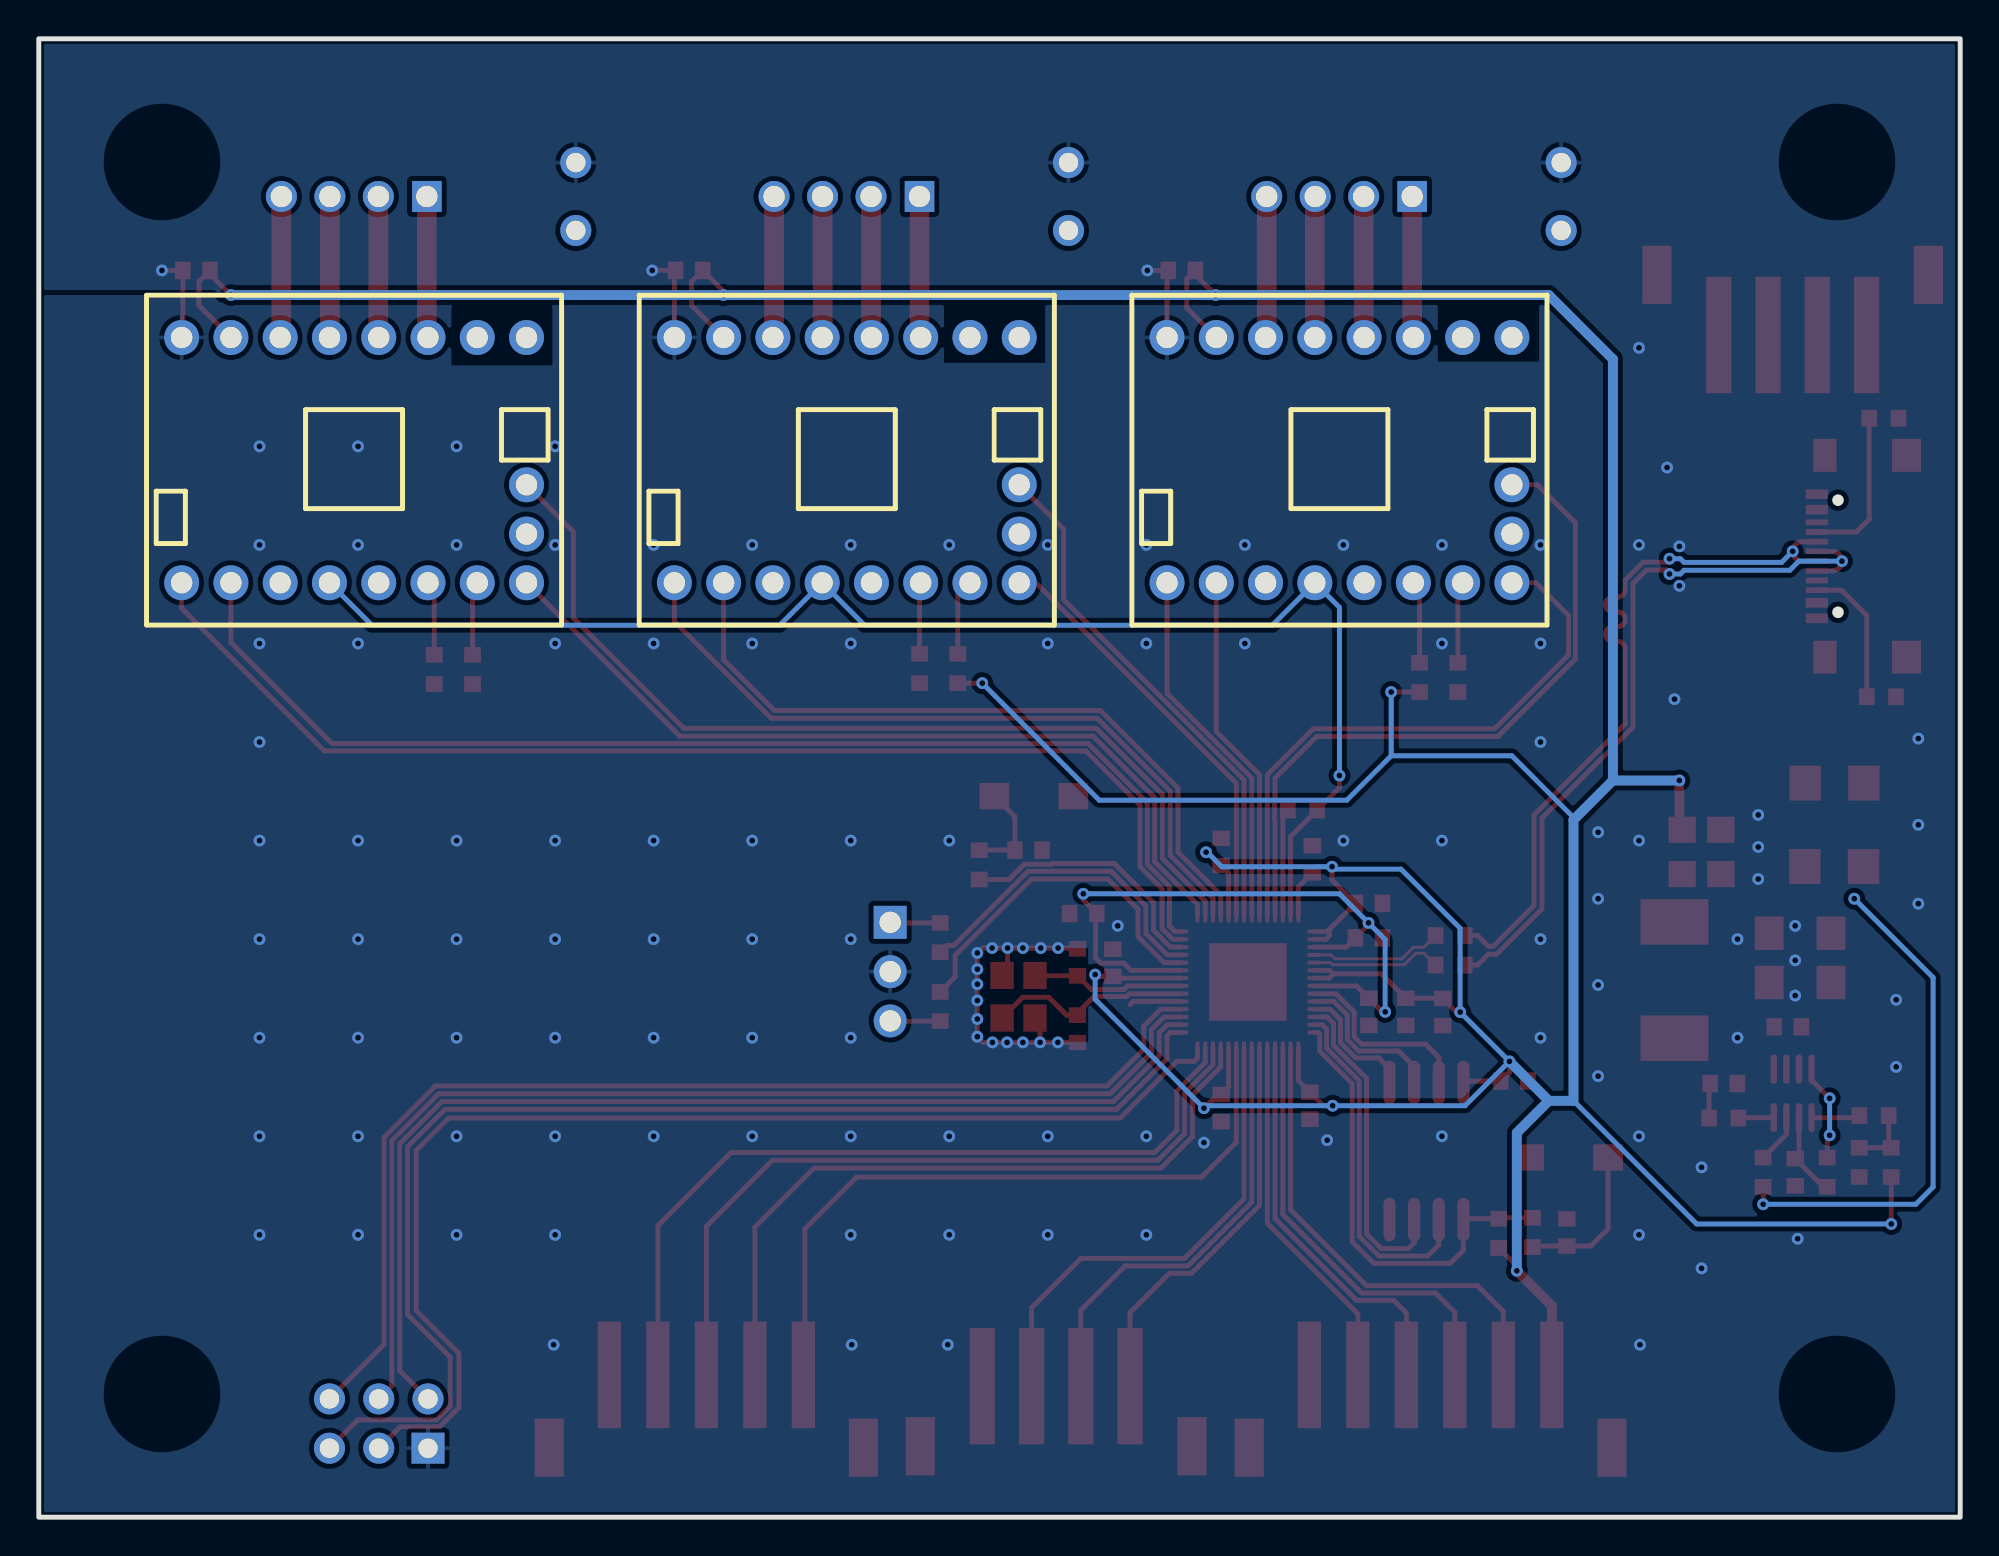
[diagram p3: board, bottom side, seen from below]

Outline 99.06 x 76.2 mm; copper layers: Top Layer, Bottom Layer. Coordinates in mm from the lower left corner of the outline.
Outline path: rectangle 0,76.2 99.06,0
Stack: Top Layer 0.035mm / Dielectric1 1.51mm FR4 er 4.5 / Bottom Layer 0.035mm

## Design rules (mm)
net $3N45: DP1
net $3N43: DP1
net RPI_USB_DM: DP2
net RPI_USB_DP: DP2
spacing copperThickness1oz (default): track to track 0.102, other pairs 0.152 to 0.3
spacing copperThickness2oz: track to track 0.203, other pairs 0.152 to 0.3
track width copperThickness1oz (default): min 0.127, default 0.254, max 2.54
track width copperThickness2oz: min 0.203, default 0.254, max 2.54
differential pair differentialPair (default): width min 0.127, default 0.254, max 2.54; gap min 0.152, default 0.152
net $1N70 uses copperRegion
net $1N63 uses copperRegion
net 3V3 uses copperRegion
net VBUS uses copperRegion
net GND uses copperRegion
net 20V uses copperRegion

## Placement (name value [footprint] x y rotation side)
C1  100uF  [CAP-TH_BD8.0-P3.50-D0.6-FD]  71.37 68.07 90 top
C2  100uF  [CAP-TH_BD8.0-P3.50-D0.6-FD]  45.97 68.07 90 top
C3  100uF  [CAP-TH_BD8.0-P3.50-D0.6-FD]  20.57 68.07 90 top
C4  10uF  [C1206]  8.25 30.1 0 top
C5  10uF  [C1206]  8.25 27.56 0 top
C6  1uF  [C0603]  8.89 25.27 0 top
C7  100nF  [C0603]  12.19 22.35 180 top
C8  10uF  [C0805]  13.33 33.15 0 top
C9  10uF  [C0805]  13.33 35.43 0 top
C10  100nF  [C0603]  8.51 17.78 270 top
C11  100nF  [C0603]  90.93 64.26 180 top
C12  100nF  [C0603]  65.53 64.26 0 top
C13  100nF  [C0603]  40.13 64.26 0 top
C25  1uF  [C0603]  26.67 26.04 270 top
C26  100nF  [C0603]  45.21 31.11 0 top
C27  100nF  [C0603]  30.49 26.05 270 top
C28  1uF  [C0603]  30.49 29.86 180 top
C29  100nF  [C0603]  22.99 22.48 180 top
C30  100nF  [C0603]  30.49 31.63 180 top
C31  100nF  [C0603]  33.4 33.91 90 top
C32  100nF  [C0603]  38.1 34.29 90 top
C33  100nF  [C0603]  43.69 28.57 90 top
C34  100nF  [C0603]  38.1 21.08 270 top
C35  100nF  [C0603]  33.53 21.21 270 top
C36  100nF  [C0603]  28.58 26.05 270 top
C37  12pF  [C0603]  45.51 28.6 270 top
C38  12pF  [C0603]  45.51 25.17 90 top
C53  DNF  [C0603]  20.28 14.68 270 top
C54  1uF  [C0603]  48.04 34.38 0 top
CN1  ZX-XH2.54-4PZZ  [CONN-TH_4P-P2.50_4PIN]  82.8 68.07 0 top
CN2  ZX-XH2.54-4PZZ  [CONN-TH_4P-P2.50_4PIN]  57.4 68.07 0 top
CN3  ZX-XH2.54-4PZZ  [CONN-TH_4P-P2.50_4PIN]  32 68.07 0 top
CN4  ZX-XH2.54-4PLT  [CONN-SMD_4P-P2.54_C9900012758]  8.64 62.48 180 top
CN5  ZX-XH2.54-5PLT  [CONN-SMD_5P-P2.50_ZX-XH2.54-5PLT]  64.64 5.46 0 top
CN6  ZX-XH2.54-6PLT  [CONN-SMD_6P-P2.50_ZX-XH2.54-6PLT]  27.31 5.46 0 top
CN7  ZX-XH2.54-4PLT  [CONN-SMD_4P-P2.54_C9900012758]  46.61 5.21 0 top
D1  SS36  [SMA_L4.3-W2.6-LS5.0-FD]  8 35.69 270 top
D2  SS36  [SMA_L4.3-W2.6-LS5.0-FD]  4.97 35.68 270 top
H1  -  [HDR-TH_6P-P2.54-V-F-R2-C3-S2.54]  81.53 4.83 0 top
H3  -  [HDR-TH_3P-P2.54-V-M]  55.17 28.12 270 top
L1  10uH  [IND-SMD_L7.3-W6.8]  14.73 27.69 90 top
R1  100K  [R0603]  6.86 17.78 270 top
R2  20R  [R0603]  12.19 20.57 0 top
R3  1M  [R0603]  10.16 17.78 270 top
R4  51K  [R0603]  4.44 20.7 0 top
R5  41.2K  [R0603]  3.56 18.29 90 top
R6  13K  [R0603]  5.21 18.29 90 top
R7  27R  [R0603]  26.29 29.98 180 top
R8  27R  [R0603]  26.29 28.46 180 top
R9  5.1K  [R0603]  4.06 42.29 180 top
R10  5.1K  [R0603]  3.94 56.64 0 top
R14  DNF  [R0603]  23.79 14.63 270 top
R15  10K  [R0603]  22.06 14.68 90 top
R16  10K  [R0603]  78.67 43.7 270 top
R17  10K  [R0603]  76.7 43.7 270 top
R18  10K  [R0603]  50.58 33.62 270 top
R19  100R  [R0603]  52.59 26.32 90 top
R20  100R  [R0603]  52.59 29.88 270 top
R21  10K  [R0603]  53.65 43.74 270 top
R22  10K  [R0603]  51.68 43.74 270 top
R23  10K  [R0603]  27.87 43.28 270 top
R24  10K  [R0603]  25.9 43.28 270 top
R25  1K  [R0603]  33.91 36.45 0 top
SW1  -  [Key_SMD_3x4x2]  20.19 18.54 180 top
SW2  -  [Key_SMD_3x4x2]  47.76 37.16 0 top
U1  TMC2209SILENTSTEPSTICK  [COMM-TH_TMC2209SILENTSTEPSTICK]  82.81 54.48 90 bottom
U2  TMC2209SILENTSTEPSTICK  [COMM-TH_TMC2209SILENTSTEPSTICK]  57.4 54.48 90 bottom
U3  TMC2209SILENTSTEPSTICK  [COMM-TH_TMC2209SILENTSTEPSTICK]  32 54.48 90 bottom
U4  MP9943GQ-Z  [QFN-8_L3.0-W3.0-P0.65-BL]  8.64 21.84 0 top
U5  RP2040  [QFN-56_L7.0-W7.0-P0.40-TL-EP4.0]  36.72 27.58 90 top
U6  W25Q128JVSIQ  [SOIC-8_L5.3-W5.3-P1.27-LS8.0-BL]  27.52 18.87 0 top
USB1  TYPE-C 16P QTWT  [USB-TYPE-C-SMD_TYPE-C-16P-QTWT]  5.08 49.53 270 top
X1  12MHz  [CRYSTAL-SMD_4P-L3.2-W2.5-BL]  48.55 26.82 270 top

## Footprints (pads in the part's own frame, mm; a bottom-side part is the same pattern mirrored in y, then rotated)
C0603
  rect 0.8x0.9 smd: 1(-0.7,0) 2(0.7,0)
C0805
  rect 1.41x1.35 smd: 1(-1,0) 2(1,0)
C1206
  rect 1.485x1.728 smd: 1(-1.593,0) 2(1.593,0)
CAP-TH_BD8.0-P3.50-D0.6-FD
  round 1.6 hole 1: 1(-1.75,0) 2(1.75,0)
COMM-TH_TMC2209SILENTSTEPSTICK
  round 1.8 hole 1.1: 1(6.32,8.89) 2(6.32,6.35) 3(6.32,3.81) 4(6.32,1.27) 5(6.32,-1.27) 6(6.32,-3.81) 7(6.32,-6.35) 8(6.32,-8.89) 9(-6.32,8.89) 10(-6.32,6.35) 11(-6.32,3.81) 12(-6.32,1.27) 13(-6.32,-1.27) 14(-6.32,-3.81) 15(-6.32,-6.35) 16(-6.32,-8.89) 17(-3.81,-8.89) 18(-1.27,-8.89)
CONN-SMD_4P-P2.54_C9900012758
  rect 1.3x6 smd: 1(-3.811,1.55) 2(-1.27,1.55) 3(1.27,1.55) 4(3.81,1.55)
  rect 1.5x3 smd: 5(7,-1.55) 6(-7,-1.55)
CONN-SMD_5P-P2.50_ZX-XH2.54-5PLT
  rect 1.2x5.5 smd: 1(-5,1.875) 2(-2.5,1.875) 3(0,1.875) 4(2.5,1.875) 5(5,1.875)
  rect 1.5x3 smd: 6(8.1,-1.875) 7(-8.1,-1.875)
CONN-SMD_6P-P2.50_ZX-XH2.54-6PLT
  rect 1.2x5.5 smd: 1(-6.25,1.875) 2(-3.75,1.875) 3(-1.25,1.875) 4(1.25,1.875) 5(3.75,1.875) 6(6.25,1.875)
  rect 1.5x3 smd: 7(9.35,-1.875) 8(-9.35,-1.875)
CONN-TH_4P-P2.50_4PIN
  rect 1.524x1.6 hole 1.1: 1(-3.75,0)
  round 1.6 hole 1.1: 2(-1.25,0) 3(1.25,0) 4(3.75,0)
CRYSTAL-SMD_4P-L3.2-W2.5-BL
  rect 1.4x1.2 smd: 1(-1.1,-0.85) 2(1.1,-0.85) 3(1.1,0.85) 4(-1.1,0.85)
HDR-TH_3P-P2.54-V-M
  rect 1.7x1.7 hole 1.1: 1(-2.54,0)
  round 1.7 hole 1.1: 2(0,0) 3(2.54,0)
HDR-TH_6P-P2.54-V-F-R2-C3-S2.54
  rect 1.7x1.6 hole 1: 1(-2.54,-1.27)
  round 1.6 hole 1: 2(-2.54,1.27) 3(0,-1.27) 4(0,1.27) 5(2.54,-1.27) 6(2.54,1.27)
IND-SMD_L7.3-W6.8
  rect 2.35x3.5 smd: 1(-3,0) 2(3,0)
Key_SMD_3x4x2
  rect 1.53x1.36 smd: 1(-2.035,0) 2(2.035,0)
QFN-8_L3.0-W3.0-P0.65-BL
  oval 0.33x1.5 smd: 1(-0.975,-1.25) 2(-0.325,-1.25) 3(0.325,-1.25) 4(0.975,-1.25) 5(0.975,1.25) 6(0.325,1.25) 7(-0.325,1.25) 8(-0.975,1.25)
QFN-56_L7.0-W7.0-P0.40-TL-EP4.0
  rect 0.665x0.2 smd: 1(-3.408,2.6) 2(-3.408,2.2) 3(-3.408,1.8) 4(-3.408,1.4) 5(-3.408,1) 6(-3.408,0.6) 7(-3.408,0.2) 8(-3.408,-0.2) 9(-3.408,-0.6) 10(-3.408,-1) 11(-3.408,-1.4) 12(-3.408,-1.8) 13(-3.408,-2.2) 14(-3.408,-2.6) 29(3.408,-2.6) 30(3.408,-2.2) 31(3.408,-1.8) 32(3.408,-1.4) 33(3.408,-1) 34(3.408,-0.6) 35(3.408,-0.2) 36(3.408,0.2) 37(3.408,0.6) 38(3.408,1) 39(3.408,1.4) 40(3.408,1.8) 41(3.408,2.2) 42(3.408,2.6)
  rect 0.2x0.665 smd: 15(-2.6,-3.408) 16(-2.2,-3.408) 17(-1.8,-3.408) 18(-1.4,-3.408) 19(-1,-3.408) 20(-0.6,-3.408) 21(-0.2,-3.408) 22(0.2,-3.408) 23(0.6,-3.408) 24(1,-3.408) 25(1.4,-3.408) 26(1.8,-3.408) 27(2.2,-3.408) 28(2.6,-3.408) 43(2.6,3.408) 44(2.2,3.408) 45(1.8,3.408) 46(1.4,3.408) 47(1,3.408) 48(0.6,3.408) 49(0.2,3.408) 50(-0.2,3.408) 51(-0.6,3.408) 52(-1,3.408) 53(-1.4,3.408) 54(-1.8,3.408) 55(-2.2,3.408) 56(-2.6,3.408)
  rect 4x4 smd: 57(0,0)
R0603
  rect 0.806x0.864 smd: 1(-0.753,0) 2(0.753,0)
SMA_L4.3-W2.6-LS5.0-FD
  rect 1.8x1.62 smd: 1(-2.15,-0.009) 2(2.15,0.009)
SOIC-8_L5.3-W5.3-P1.27-LS8.0-BL
  oval 0.63x2.25 smd: 1(-1.905,-3.53) 2(-0.635,-3.53) 3(0.635,-3.53) 4(1.905,-3.53) 5(1.905,3.53) 6(0.635,3.53) 7(-0.635,3.53) 8(-1.905,3.53)
USB-TYPE-C-SMD_TYPE-C-16P-QTWT
  rect 1.7x1.2 smd: 0(-5.2,1.891) 0(5.2,1.891)
  rect 1.7x1.5 smd: 0(-5.2,-2.309) 0(5.2,-2.309)
  rect 0.5x1.14 smd: A1(-3.2,2.308) A4(-2.4,2.308) A9(2.4,2.308) A12(3.2,2.308)
  rect 0.3x1.14 smd: A5(-1.25,2.308) A6(-0.25,2.308) A7(0.25,2.308) A8(1.25,2.309) B5(1.75,2.308) B6(0.75,2.308) B7(-0.75,2.308) B8(-1.75,2.309)

## Nets
As in the schematic.

Pads without a net: U1 11 13 17; U2 11 13 17; U3 11 13 17; USB1 A8 B8

## Via types
v1: diameter 0.61, hole 0.305, Top Layer to Bottom Layer, 158 vias

## Routing (per net, layer and track width the routed paths; a pad name or vN(x,y) marks a point on that pad's centre or on a via; arc(x,y) is an arc through that point)
3V3: length 307.3
  Top Layer w0.254: U5.33 37.72,33.18 38.85,34.3 ; v1(63.77,62.99) 63.77,63.2 C12.1 65.41,63.69 65.41,62.46 U2.2 ; v1(44.6,27.97) 44.51,27.87 C33.1 43.6,27.78 U5.22 ; v1(22.86,12.7) 22.86,12.95 23.79,13.88 ; 32.51,30.31 32.63,30.18 U5.43 ; 32.51,30.31 C30.1 32.38,32.83 v1(32.38,33.53) 33.08,33.53 C31.1 34.12,32.49 U5.42 ; 32.51,30.31 32.51,29.97 32.7,29.78 U5.44 ; U1.2 90.81,62.45 90.81,63.69 C11.2 90.23,64.07 v1(89.15,62.99) ; 32.32,28 32.54,27.78 U5.49 ; 32.32,28 32.5,28.18 U5.48 ; 32.32,28 29.84,28 C36.1 26.68,26.75 25.97,26.03 v1(25.78,26.03) ; R22.2 v1(50.42,42.99) ; v1(23.24,23.49) 23.24,22.92 C29.1 25.53,22.48 U6.8 ; v1(38.39,62.99) 39.43,64.04 C13.1 39.88,63.82 39.88,62.33 U3.2 ; R5.1 v1(3.56,15.11) ; v1(32.35,21.21) 32.83,21.21 C35.1 34.12,22.5 U5.1 ; R23.2 v1(29.34,42.53) ; U5.10 37.72,22.16 C34.1 38.29,21.78 v1(38.99,21.08)
  Top Layer w0.508: v1(22.86,12.7) 21.06,10.89 CN6.1 ; C9.2 14.48,35.58 v1(14.48,37.97)
  Bottom Layer w0.254: 29.34,39.24 23.11,39.24 19.81,35.94 ; 29.34,39.24 31.62,36.96 44.39,36.96 v1(50.42,42.99) ; 29.34,39.24 v1(29.34,42.53) ; v1(44.6,27.97) 44.6,26.69 v1(38.99,21.08) 38.86,21.21 v1(32.35,21.21) 25.53,21.21 v1(23.24,23.49) v1(25.78,26.03) 25.78,30.35 28.83,33.4 32.26,33.4 v1(32.38,33.53) 38.07,33.53 38.85,34.3 ; v1(3.56,15.11) 13.59,15.11 19.94,21.46
  Bottom Layer w0.508: 21.21,21.46 v1(23.24,23.49) ; 21.21,21.46 19.94,21.46 19.94,35.94 17.91,37.97 ; 21.21,21.46 22.86,19.81 v1(22.86,12.7) ; v1(89.15,62.99) v1(63.77,62.99) v1(38.39,62.99) 21.21,62.99 17.91,59.69 17.91,37.97 ; 17.91,37.97 v1(14.48,37.97)
  vias: v1(38.88,34.27)
GND: length 34.3
  Top Layer w0.254: v1(47.44,24.47) v1(46.52,24.47) C38.1 ; v1(47.44,24.47) 47.44,25.46 X1.2 ; v1(47.44,24.47) v1(48.32,24.47) v1(49.14,24.47) v1(49.9,24.47) 50.38,24.47 v1(50.67,24.76) v1(50.67,25.68) v1(50.67,26.63) v1(50.67,27.47) v1(50.67,28.25) v1(50.67,29.08) 50.42,29.34 v1(49.91,29.34) v1(49.12,29.34) ; v1(49.12,29.34) 49.12,28.21 X1.4 ; v1(49.12,29.34) v1(48.32,29.34) v1(47.41,29.34) v1(46.51,29.34) 45.54,29.34 C37.1 ; U3.1 40.89,64.2 C13.2 v1(41.91,64.26) ; v1(92.71,64.26) C11.1 91.63,60.87 U1.1 ; U5.19 42.63,26.58 42.8,26.42 ; v1(67.44,64.26) C12.2 66.29,64.2 U2.1
  vias: v1(2.16,40.13) v1(2.16,35.69) v1(2.16,31.62) v1(3.3,26.67) v1(3.3,23.21) v1(8.38,14.35) v1(8.51,30.48) v1(8.51,28.7) v1(8.51,26.89) v1(10.41,36.19) v1(10.41,34.54) v1(10.41,32.89) v1(11.48,29.79) v1(11.48,24.71) v1(13.33,18.03) v1(13.33,12.83) v1(14.48,50.04) v1(14.48,48.01) v1(14.73,42.16) v1(15.11,54.1) v1(16.51,8.89) v1(16.56,60.27) v1(16.56,50.11) v1(16.56,34.87) v1(16.56,19.63) v1(16.56,14.55) v1(18.67,35.31) v1(18.67,31.88) v1(18.67,27.43) v1(18.67,22.73) v1(21.64,50.11) v1(21.64,45.03) v1(21.64,39.95) v1(21.64,29.79) v1(21.64,24.71) v1(26.72,50.11) v1(26.72,45.03) v1(26.72,34.87) v1(26.72,19.63) v1(31.8,50.11) v1(31.8,34.87) v1(32.64,19.43) v1(36.88,50.11) v1(36.88,45.03) v1(38.99,19.3) v1(41.96,50.11) v1(41.96,45.03) v1(41.96,19.63) v1(41.96,14.55) v1(43.43,30.48) v1(47.04,50.11) v1(47.04,45.03) v1(47.04,19.63) v1(47.04,14.55) v1(52.12,50.11) v1(52.12,34.87) v1(52.12,19.63) v1(52.12,14.55) v1(52.2,8.89) v1(57.2,50.11) v1(57.2,45.03) v1(57.2,34.87) v1(57.2,29.79) v1(57.2,24.71) v1(57.2,19.63) v1(57.2,14.55) v1(57.15,8.89) v1(62.28,50.11) v1(62.28,45.03) v1(62.28,34.87) v1(62.28,29.79) v1(62.28,24.71) v1(62.28,19.63) v1(67.36,50.11) v1(67.36,45.03) v1(67.36,34.87) v1(67.36,29.79) v1(67.36,24.71) v1(67.36,19.63) v1(72.44,55.19) v1(72.44,50.11) v1(72.44,45.03) v1(72.44,34.87) v1(72.44,29.79) v1(72.44,24.71) v1(72.44,19.63) v1(72.44,14.55) v1(72.52,8.89) v1(77.52,55.19) v1(77.52,50.11) v1(77.52,34.87) v1(77.52,29.79) v1(77.52,24.71) v1(77.52,19.63) v1(77.52,14.55) v1(82.6,55.19) v1(82.6,50.11) v1(82.6,45.03) v1(82.6,34.87) v1(82.6,29.79) v1(82.6,24.71) v1(82.6,19.63) v1(82.6,14.55) v1(87.68,55.19) v1(87.68,50.11) v1(87.68,45.03) v1(87.68,39.95) v1(87.68,34.87) v1(87.68,29.79) v1(87.68,24.71) v1(87.68,19.63) v1(87.68,14.55)
DCDC_EN: length 2.6
  Top Layer w0.254: U4.3 8.96,19.73 R3.1
DCDC_PG: length 4.4
  Top Layer w0.254: R1.2 7.06,17.03 C10.1 8.31,18.68 U4.2
EXPOSURE_SYNC: length 25.1
  Top Layer w0.254: 47.88,6.76 47.88,10.8 45.34,13.33 39.99,13.33 36.92,16.41 U5.8
FALSH_SCLK: length 8.1
  Top Layer w0.254: U5.52 32.3,26.58 31.6,25.88 31.6,24.62 31.01,24.03 28.96,24.03 28.15,23.22 U6.6
FLASH_CS: length 23.4
  Top Layer w0.254: U5.56 33.11,24.98 33.02,24.89 33.02,24.03 31.34,22.35 31.34,14.2 30.23,13.08 26.29,13.08 25.61,13.76 U6.1 25.57,15.39 R14.1 23.75,15.43 R15.2
FLASH_SD0: length 6.6
  Top Layer w0.254: U6.5 29.42,23.12 29.97,23.67 31.16,23.67 31.95,24.47 31.95,25.65 32.48,26.18 U5.53
FLASH_SD1: length 18.2
  Top Layer w0.254: U6.2 26.88,14.04 27.46,13.46 29.97,13.46 30.99,14.48 30.99,22.5 32.67,24.17 32.67,25.17 32.88,25.38 U5.55
FLASH_SD2: length 16.8
  Top Layer w0.254: U6.3 28.14,15.33 28.14,14.15 28.45,13.84 29.84,13.84 30.61,14.6 30.61,22.62 32.31,24.32 32.31,25.45 32.64,25.78 U5.54
FLASH_SD3: length 9.8
  Top Layer w0.254: U5.51 32.19,26.98 31.24,26.03 31.24,24.76 30.86,24.38 27.56,24.38 26.88,23.71 U6.7
LED_PWM1: length 36.5
  Top Layer w0.254: CN5.1 59.56,7.42 59.56,14.86 56.9,17.53 39.12,17.53 37.32,19.32 U5.9
LED_PWM2: length 37.3
  Top Layer w0.254: U5.11 38.12,23.22 39.59,21.75 39.59,19.61 41.2,18 59.09,18 62.14,14.95 CN5.2
LED_PWM3: length 39.3
  Top Layer w0.254: U5.12 38.52,23.33 39.99,21.86 39.99,19.77 41.36,18.4 61.23,18.4 64.64,14.99 CN5.3
LED_PWM4: length 41.3
  Top Layer w0.254: U5.13 38.92,23.43 40.39,21.97 40.39,19.94 41.53,18.8 63.37,18.8 67.14,15.03 CN5.4
M1_DIAG: length 49.2
  Top Layer w0.254: U5.30 38.92,31.74 41.13,33.95 41.13,37.25 44.54,40.66 65.81,40.66 71.5,46.35 71.5,50.8 U1.18
M1_DIR: length 63
  Top Layer w0.254: U5.27 40.59,29.78 41.15,30.34 41.15,32.39 42.29,33.53 42.29,36.7 45.09,39.5 84.34,39.5 91.7,46.85 U1.9
M1_EN: length 44
  Top Layer w0.254: U1.16 66.01,40.26 44.7,40.26 41.53,37.08 41.53,33.78 39.32,31.58 U5.29
M1_STEP: length 61.3
  Top Layer w0.254: U5.28 40.49,30.18 40.77,30.46 40.77,32.51 41.91,33.65 41.91,36.83 44.96,39.88 83.95,39.88 89.16,45.09 U1.10
M1_UART: length 73.2
  Top Layer w0.254: v1(32,38.23) 32,37.6 R25.1 34.52,35.08 U5.41
  Bottom Layer w0.254: U1.12 81.89,45.97 60.86,45.97 U2.12 56.48,45.97 35.46,45.97 U3.12 32,46.89 v1(32,38.23)
M2_DIAG: length 27
  Top Layer w0.254: U2.18 46.23,50.93 46.23,47.3 36.92,38 U5.35
M2_DIR: length 38.5
  Top Layer w0.254: U2.9 66.29,46.17 61.3,41.18 44.49,41.18 40.73,37.42 40.73,34.12 38.52,31.91 U5.31
M2_EN: length 22.3
  Top Layer w0.254: U2.16 47.66,48.16 37.32,37.83 U5.34
M2_STEP: length 37.6
  Top Layer w0.254: U5.32 38.12,32.08 40.33,34.28 40.33,37.58 44.32,41.58 61.13,41.58 63.75,44.19 U2.10
M3_DIAG: length 36.3
  Top Layer w0.254: U3.18 21.79,53.21 19.84,51.26 19.84,44.24 23.84,40.24 33.18,40.24 35.32,38.1 35.32,37.02 35.34,37 35.34,35.9 35.32,35.88 U5.39
M3_DIR: length 19
  Top Layer w0.254: U3.9 40.89,42.47 36.52,38.1 U5.36
M3_EN: length 31
  Top Layer w0.254: U3.16 21.88,48.16 20.19,46.48 20.19,44.45 24,40.64 33.35,40.64 35.72,38.27 U5.38
M3_STEP: length 18.1
  Top Layer w0.254: U5.37 36.12,38.27 38.35,40.5 U3.10
RPI_GPIO11: length 61.9
  Top Layer w0.254: U5.14 39.32,23.67 39.5,23.49 40.39,23.49 43.31,20.58 77.93,20.58 79.61,18.9 79.61,10.64 77.4,8.44 77.4,5.66 78.4,4.66 80.43,4.66 H1.3
RPI_GPIO12: length 64.5
  Top Layer w0.254: U5.15 40.72,24.98 40.9,24.8 40.9,23.62 43.49,21.02 78.12,21.02 80.06,19.09 80.06,10.46 77.85,8.25 77.85,5.71 78.55,5.02 82.61,5.02 H1.5
RPI_GPIO13: length 57.3
  Top Layer w0.254: U5.16 40.88,25.38 41.3,24.97 41.3,23.78 43.66,21.42 78.28,21.42 80.46,19.25 80.46,7.56 H1.2
RPI_GPIO14: length 57.7
  Top Layer w0.254: U5.17 41.05,25.78 41.7,25.14 41.7,23.95 43.82,21.82 78.45,21.82 80.85,19.42 80.85,6.77 H1.4
RPI_GPIO15: length 59.2
  Top Layer w0.254: U5.18 41.21,26.18 42.1,25.3 42.1,24.12 43.99,22.22 78.61,22.22 81.25,19.58 81.25,8.91 H1.6
RPI_SPI0_CS: length 22.7
  Top Layer w0.254: CN6.3 26.06,10.56 27.05,11.56 30.86,11.56 34.92,15.62 U5.3
RPI_SPI0_RX: length 24.7
  Top Layer w0.254: U5.2 34.52,15.85 30.61,11.94 24.89,11.94 23.56,10.6 CN6.2
RPI_SPI0_SCK: length 20.8
  Top Layer w0.254: CN6.4 28.56,10.52 29.21,11.18 31.12,11.18 35.32,15.38 U5.4
RPI_SPI0_TX: length 18.8
  Top Layer w0.254: CN6.5 31.06,10.48 35.72,15.15 U5.5
RPI_UART0_TX: length 5.6
  Top Layer w0.254: U5.40 34.92,36.19 R25.2
RPI_UART1_RX: length 23
  Top Layer w0.254: U5.7 36.52,16.24 39.81,12.95 43.05,12.95 45.34,10.67 45.34,6.76
RPI_UART1_TX: length 20.9
  Top Layer w0.254: U5.6 36.12,16.07 39.62,12.57 40.77,12.57 42.8,10.54 42.8,6.76
RPI_USB_DM: length 38.6
  Top Layer w0.254: R7.2 24.88,29.98 24.33,29.42 24.07,29.42 21.97,31.52 21.97,36.19 17.27,40.89 17.27,44.76 arc(17.38,45.03) 17.65,45.14 17.91,45.14 arc(18.29,45.52) 17.91,45.9 17.65,45.9 arc(17.27,46.28) 17.65,46.66 17.91,46.66 arc(18.29,47.04) 17.91,47.43 17.65,47.43 arc(17.38,47.54) 17.27,47.81 17.27,48.3 16.35,49.23 15.16,49.23 v1(14.99,49.4) ; USB1.B7 8.14,50.28 arc(8.49,50.13) v1(8.64,49.78) arc(8.49,49.43) 8.13,49.28 USB1.A7
  Bottom Layer w0.254: v1(8.64,49.78) 9.21,49.21 14.24,49.21 14.43,49.4 v1(14.99,49.4)
RPI_USB_DP: length 38.5
  Top Layer w0.254: USB1.A6 6.6,49.78 arc(6.24,49.63) v1(6.1,49.28) arc(6.24,48.93) 6.59,48.78 USB1.B6 ; v1(14.99,48.62) 15.19,48.82 16.18,48.82 16.87,48.13 16.87,40.73 21.56,36.03 21.56,31.36 23.9,29.02 24.33,29.02 24.88,28.46 R8.2
  Bottom Layer w0.254: v1(14.99,48.62) 14.43,48.62 14.24,48.81 8.79,48.81 8.32,49.28 v1(6.1,49.28)
$1N42: length 7.3
  Top Layer w1.016: CN3.4 35.75,60.86 U3.3
$1N43: length 7.3
  Top Layer w1.016: CN3.3 33.27,68.05 U3.4
$1N44: length 7.3
  Top Layer w1.016: CN3.2 30.75,60.83 U3.5
$1N45: length 7.3
  Top Layer w1.016: 28.19,60.8 28.25,60.86 CN3.1
$1N46: length 7.3
  Top Layer w1.016: U2.3 61.15,60.86 CN2.4
$1N47: length 7.3
  Top Layer w1.016: U2.4 58.65,60.82 CN2.3
$1N48: length 7.3
  Top Layer w1.016: CN2.2 56.15,60.82 U2.5
$1N49: length 7.3
  Top Layer w1.016: CN2.1 53.65,60.86 U2.6
$1N50: length 7.3
  Top Layer w1.016: CN1.4 86.55,60.86 U1.3
$1N51: length 7.3
  Top Layer w1.016: U1.4 84.05,60.82 CN1.3
$1N52: length 7.3
  Top Layer w1.016: CN1.2 81.55,60.82 U1.5
$1N53: length 7.3
  Top Layer w1.016: U1.6 79.05,60.86 CN1.1
$1N62: length 5
  Top Layer w0.254: U4.8 7.66,22.52 v1(6.73,21.59) ; v1(6.73,19.68) 6.86,19.56 R1.1
  Bottom Layer w0.254: v1(6.73,21.59) v1(6.73,19.68)
$1N63: length 26.6
  Top Layer w0.254: R3.2 v1(10.16,16.13)
  Bottom Layer w0.254: v1(10.16,16.13) 2.29,16.13 1.4,17.02 1.4,27.81 v1(5.46,31.88)
$1N68: length 1.8
  Top Layer w0.254: R2.2 12.95,22.3 C7.1
$1N69: length 1.8
  Top Layer w0.254: 9.61,20.59 11.42,20.59 R2.1
$1N77: length 3.4
  Top Layer w0.254: R4.1 3.69,19.18 R5.2 R6.2
$1N78: length 2.5
  Top Layer w0.254: U4.1 5.31,20.59 R4.2
$1N115: length 8.2
  Top Layer w0.254: R10.2 4.69,51.44 5.35,50.78 USB1.A5
$1N116: length 7.3
  Top Layer w0.254: USB1.B5 6.12,47.78 4.82,46.47 R9.1
$1N122: length 3.8
  Top Layer w0.254: 78.67,44.45 78.67,47.84 U1.14
$1N123: length 3.8
  Top Layer w0.254: U1.15 76.7,47.92 76.7,44.45
$1N126: length 3.9
  Top Layer w0.254: R22.1 51.68,47.54 U2.15
$1N127: length 3.7
  Top Layer w0.254: R21.1 53.65,48.1 U2.14
$1N129: length 4.2
  Top Layer w0.254: U3.15 25.9,47.92 25.9,44.04
$1N130: length 4.3
  Top Layer w0.254: 27.87,44.04 27.87,47.84 28.19,48.16
$3N13: length 2.6
  Top Layer w0.254: H3.3 55.16,25.57 R19.1
$3N14: length 2.6
  Top Layer w0.254: R20.1 55.14,30.63 H3.1
$3N15: length 16.8
  Top Layer w0.254: R20.2 52.25,29.46 51.89,29.46 48.06,33.29 43.78,33.29 41.99,31.5 41.99,30.09 40.88,28.98 U5.25
$3N16: length 18.1
  Top Layer w0.254: R19.2 51.82,27.85 51.82,28.96 47.88,32.89 43.94,32.89 42.39,31.34 42.39,29.92 41.05,28.58 U5.24
$3N18: length 8
  Top Layer w0.254: X1.1 47.68,27.9 C37.2 44.8,27.2 43.12,27.2 42.93,27.38 U5.21
$3N19: length 10.6
  Top Layer w0.254: X1.3 48.33,26.8 46.99,26.8 46.07,25.87 C38.2 45.51,25.99 44.66,26.84 42.97,26.84 42.83,26.98 U5.20
$3N20: length 5.1
  Top Layer w0.254: SW2.2 48.74,36.11 C54.2 50.57,34.38 R18.1
$3N22: length 13.4
  Top Layer w0.254: R18.2 49.03,32.87 48.25,33.65 46.82,33.65 46.78,33.69 43.61,33.69 41.59,31.67 41.59,30.25 40.72,29.38 U5.26
$3N28: length 8
  Top Layer w0.254: R15.1 22,13.98 19.04,13.98 18.16,14.86 SW1.2
$3N38: length 36.2
  Top Layer w0.254: v1(30.5,30.63) 30.5,30.54 C28.1 31.66,29.38 U5.45 ; v1(29.65,26.05) 29.78,26.05 C27.1 31.12,27.38 U5.50 ; v1(45.21,32.13) 45.21,31.81 C26.1 44.58,31.05 44.58,28.83 44.3,28.55 43.12,28.55 42.75,28.18 U5.23
  Bottom Layer w0.254: v1(29.65,26.05) 29.65,29.78 v1(30.5,30.63) 32,32.13 v1(45.21,32.13)
$3N43: length 6.8
  Top Layer w0.152: U5.47 32.47,28.58 32.36,28.48 28.66,28.48 28.06,29.07 27.66,29.07 R8.1
$3N45: length 6.8
  Top Layer w0.152: R7.1 27.66,29.37 28.19,29.37 28.78,28.78 32.24,28.78 32.44,28.98 U5.46

## Copper pours and planes (outline as drawn; the poured copper is in the pictures)
3V3 on Top Layer: 13.59,36.19 15.49,36.19 15.49,32.77 16.26,32 16.64,32 16.64,29.34 12.83,29.34 12.83,32 13.21,32 13.59,32.38
20V on Top Layer: 42.99,58.61 42.99,65.34 45.02,67.37 46.93,67.37 49.47,64.83 49.47,59.75 47.43,59.75 47.43,64.33 46.55,65.21 45.78,65.21 45.15,64.58 45.15,58.61
20V on Top Layer: 9.14,64.01 13.21,64.01 13.21,41.15 8.89,36.83 7.11,36.83 7.11,38.73 10.8,42.42 10.8,56.13 9.14,57.78
20V on Top Layer: 17.65,58.67 17.65,65.4 19.69,67.44 21.59,67.44 24.13,64.9 24.13,59.82 22.1,59.82 22.1,64.39 21.21,65.28 20.45,65.28 19.81,64.64 19.81,58.67
20V on Top Layer: 68.39,58.61 68.39,65.34 70.42,67.37 72.33,67.37 74.87,64.83 74.87,59.75 72.83,59.75 72.83,64.33 71.95,65.21 71.18,65.21 70.55,64.58 70.55,58.61
20V on Top Layer: 13.21,64.01 13.21,59.56 13.59,59.18 70.61,59.18 70.61,55.63 13.97,55.63 13.33,54.99 12.06,54.99 9.14,57.91 9.14,64.01
GND on Top Layer: -5.33,78.74 103.25,78.74 103.25,-4.06 -5.33,-4.06
GND on Bottom Layer: -3.81,78.87 103.63,78.87 103.63,-1.52 -3.81,-1.52
VBUS on Top Layer: 4.06,36.83 4.06,38.61 8.13,42.67 8.13,46.74 8,46.86 6.73,46.86 6.73,47.37 8.89,47.37 9.27,47.75 9.27,51.31 8.89,51.69 6.73,51.69 6.73,52.2 10.29,52.2 10.67,51.82 10.67,46.99 9.91,46.23 9.91,41.78 5.84,37.72 5.84,36.83
$1N63 on Top Layer: 8,22.22 8,24.51 5.59,26.92 5.59,31.11 4.06,32.64 4.06,34.54 8.89,34.54 8.89,32.51 7.49,31.11 7.49,26.54 8.64,25.4 8.64,24.76 8.51,24.64 8.51,22.22
$1N70 on Top Layer: 8.76,23.88 9.14,23.88 9.14,22.22 9.27,22.1 10.29,22.1 12.83,24.64 12.83,26.03 16.64,26.03 16.64,23.37 12.83,23.37 12.32,22.86 12.32,22.1 11.68,21.46 9.14,21.46 8.76,21.84

## Text on the board
Top Silkscreen Layer: Project PRISM / Apr 3, 2026
